# EAGLE design LCmeter0-LCD3310-8pinlcd-PIC-COMP (EAGLE 7.6.0)
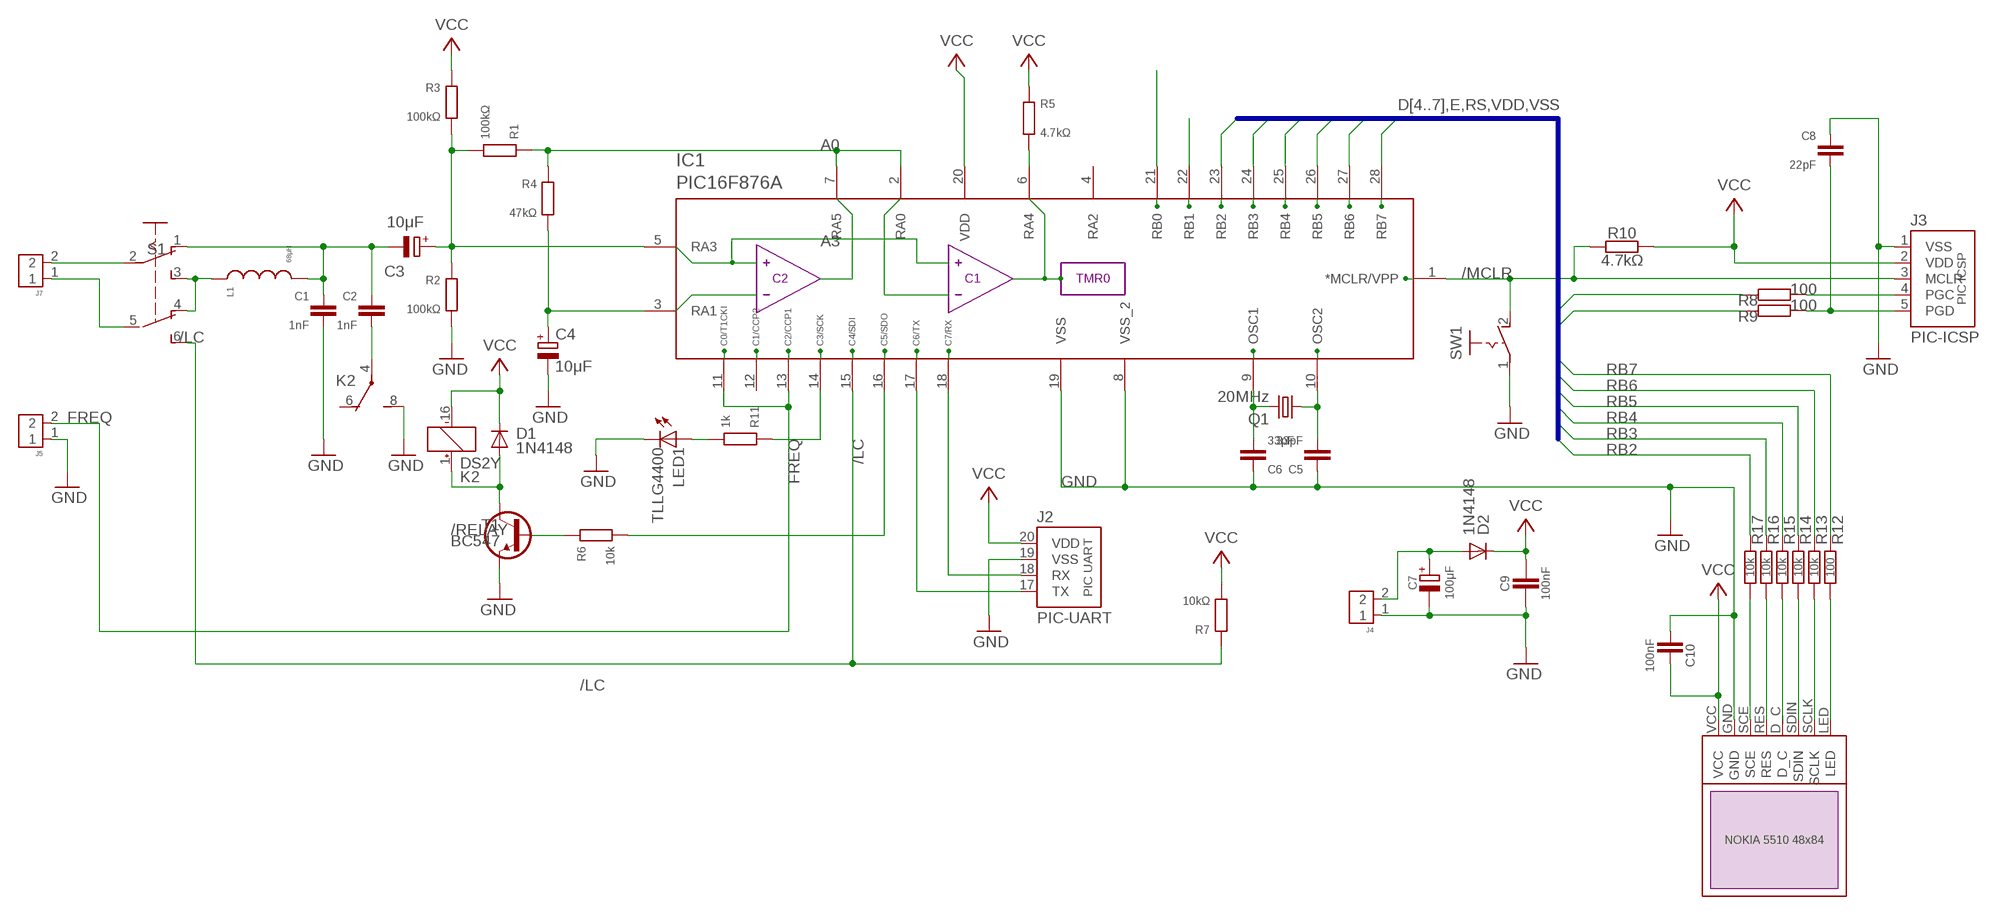
[diagram p0: schematic, sheet 1]

## Parts
C1  1nF  C025-025X060  [C050-025X060]
C2  1nF  C025-025X060  [C050-025X060]
C3  10μF  CPOLE2,5-4  [E2,5-4]
C4  10μF  CPOLE2,5-4  [E2,5-4]
C5  33pF  C025-020X036  [C025-020X036]
C6  33pF  C025-020X036  [C025-020X036]
C7  100μF  CPOLE5-5  [E5-5]
C8  22pF  C050-020X036  [C050-020X036]
C9  100nF  C-EU025-024X044  [C025-024X044]
C10  100nF  C025-015X024  [C025-015X024/V]
D1  1N4148  1N414834-7  [DO34-7]
D2  1N4148  1N414834-10V  [DO34-10V]
IC1  PIC16F876A  PIC16F876A-X/SP-COMPDIL28-3/V  [DIL28-3/V]
J2  PIC-UART  [PIC-UART]
J3  PIC-ICSP  PIC-ICSPICSP  [PIC-ICSP]
J4  J4  CONN-2P2P/H  [CONN-2P]
J5  CONN-2P2P/V  [CONN-2P-V]
J6  NOKIA-5510-48X84  [CONN-LCD5510]
J7  CONN-2P2P/V  [CONN-2P-V]
K2  DS2Y  DS2Y-S-DC5V  [DS2Y]
L1  68μH  L-09R  [L-09R]
LED1  TLLG4400  [LED3MM]
Q1  20MHz  CRYSTALHC49  [HC49]
R1  100kΩ  R0202/7  [0202/7]
R2  100kΩ  R0202/7  [0202/7]
R3  100kΩ  R0202/7  [0202/7]
R4  47kΩ  R0202/7  [0202/7]
R5  4.7kΩ  R0202/7  [0202/7]
R6  10k  R0202/7-V  [0202/7-V]
R7  10kΩ  R0202/10-V  [0202/10-V]
R8  100  R0202/7  [0202/7]
R9  100  R0202/2V  [0202/2V]
R10  4.7kΩ  R0202/7  [0202/7]
R11  1k  R0202/5-V  [0202/5-V]
R12  100  R0202/7  [0202/7]
R13  10k  R0202/7  [0202/7]
R14  10k  R0202/7  [0202/7]
R15  10k  R0202/7  [0202/7]
R16  10k  R0202/7  [0202/7]
R17  10k  R0202/7  [0202/7]
S1  SL-SW-2P-2T-H  [SLSW-2P2T-H]
SW1  PB-1P-1T  [PB-1P1T]
T1  BC547  BC547CBE-A  [TO92-CBE-A]

## Nets
/LC: IC1.15(RC4) R7.2 S1.6(S1)
/MCLR: IC1.1(*MCLR/VPP) J3.3(MCLR) R10.2 SW1.2(S)
/RELAY: D1.A K2.1(1:+) T1.C
A0: IC1.2(RA0) IC1.7(RA5) R1.2 R4.2
A1: C4.+ IC1.3(RA1) R4.1
A3: C3.+ IC1.5(RA3) R1.1 R2.2 R3.1
A4: IC1.6(RA4) R5.1
C2_CON: C2.2 K2.4(2:P)
FREQ: IC1.11(RC0) IC1.13(RC2) J5.2
GND: C1.2 C4.- C5.1 C6.1 C7.- C8.1 C9.2 C10.1 IC1.8(VSS_2) IC1.19(VSS) J2.19(VSS) J3.1(VSS) J4.1 J5.1 J6.GND K2.8(2:S) LED1.K(C) R2.1 SW1.1(P) T1.E
M+: J7.2 S1.2(P)
M-: J7.1 S1.5(P1)
N$1: LED1.A R11.1
N$2: C1.1 C2.1 C3.- L1.P$2 S1.1(O)
N$3: J6.LED R12.1
N$4: J6.D_C R15.1
N$5: IC1.14(RC3) R11.2
N$6: R6.2 T1.B
N$7: L1.P$1 S1.3(S) S1.4(O1)
N$8: IC1.16(RC5) R6.1
N$9: IC1.18(RC7) J2.18(RX)
N$10: IC1.17(RC6) J2.17(TX)
N$11: IC1.21(RB0)
N$12: C7.+ D2.A J4.2
N$13: J6.SDIN R14.1
N$14: J6.SCLK R13.1
N$15: J6.RES R16.1
N$16: J6.SCE R17.1
N$17: IC1.22(RB1)
OSC1: C6.2 IC1.9(OSC1) Q1.2
OSC2: C5.2 IC1.10(OSC2) Q1.1
PGC: J3.4(PGC) R8.1
PGD: C8.2 J3.5(PGD) R9.1
RB2: IC1.23(RB2) R17.2
RB3: IC1.24(RB3) R16.2
RB4: IC1.25(RB4) R15.2
RB5: IC1.26(RB5) R14.2
RB6: IC1.27(RB6) R8.2 R13.2
RB7: IC1.28(RB7) R9.2 R12.2
VCC: C9.1 C10.2 D1.C D2.C IC1.20(VDD) J2.20(VDD) J3.2(VDD) J6.VCC K2.16(1:-) R3.2 R5.2 R7.1 R10.1
Unconnected: IC1.4(RA2) IC1.12(RC1) K2.6(2:O) K2.9(3:S) K2.11(3:O) K2.13(3:P)

## Buses
D[4..7],E,RS,VDD,VSS

## Library data of the parts
C1 C2 C5 C6 C8 C10 = c:C: CAPACITOR, European symbol
C3 C4 C7 = c:CPOL: POLARIZED CAPACITOR, European symbol
C9 = rcl:C-EU: CAPACITOR, European symbol
D1 D2 = d:1N4148
IC1 = mcu:PIC16F876A-X/SP-COMP
J2 = pinconn:PIC-UART
J3 = pinconn:PIC-ICSP
J4 J5 J7 = pinconn:CONN-2P
J6 = lcd:NOKIA-5510-48X84
K2 = relay:DS2Y-S-DC*: MINIATURE RELAY NAiS Source: http://www.mew-europe.com/.. en_ds_61005_0023.pdf; MPN: DS2Y-S-DC5V; OC_FARNELL: unknown; OC_NEWARK: 13P3268
L1 = r:L
LED1 = led:TLLG4400: Low Current (2mA) LED 3 mm Tinted Diffused Package color GREEN Source: Data sheet <http://www.farnell.com/datasheets/391098.pdf>; MF: VISHAY SEMICONDUCTOR; OC_FARNELL: 1612435
Q1 = q:CRYSTAL
R1-R17 = r:R: RESISTOR, European symbol
S1 = sw:SL-SW-2P-2T
SW1 = sw:PB-1P-1T
T1 = t:BC547

## Net classes
0 default: width 0.61 mm

## Board
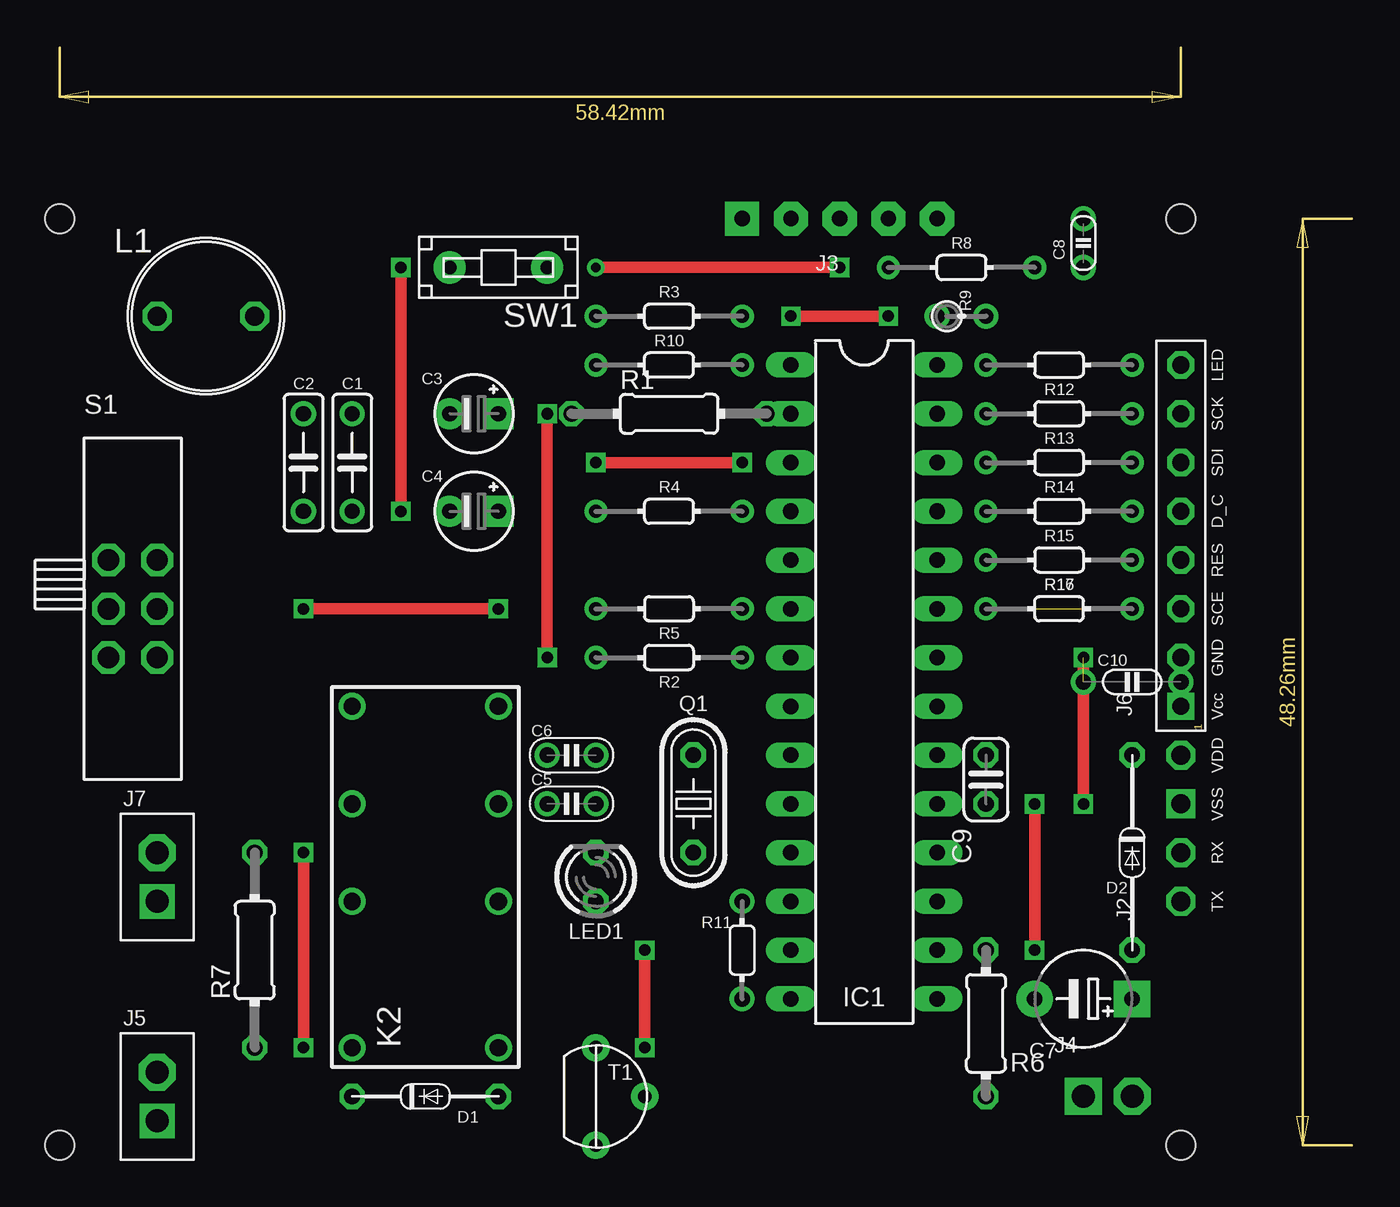
[diagram p1: board, top side]
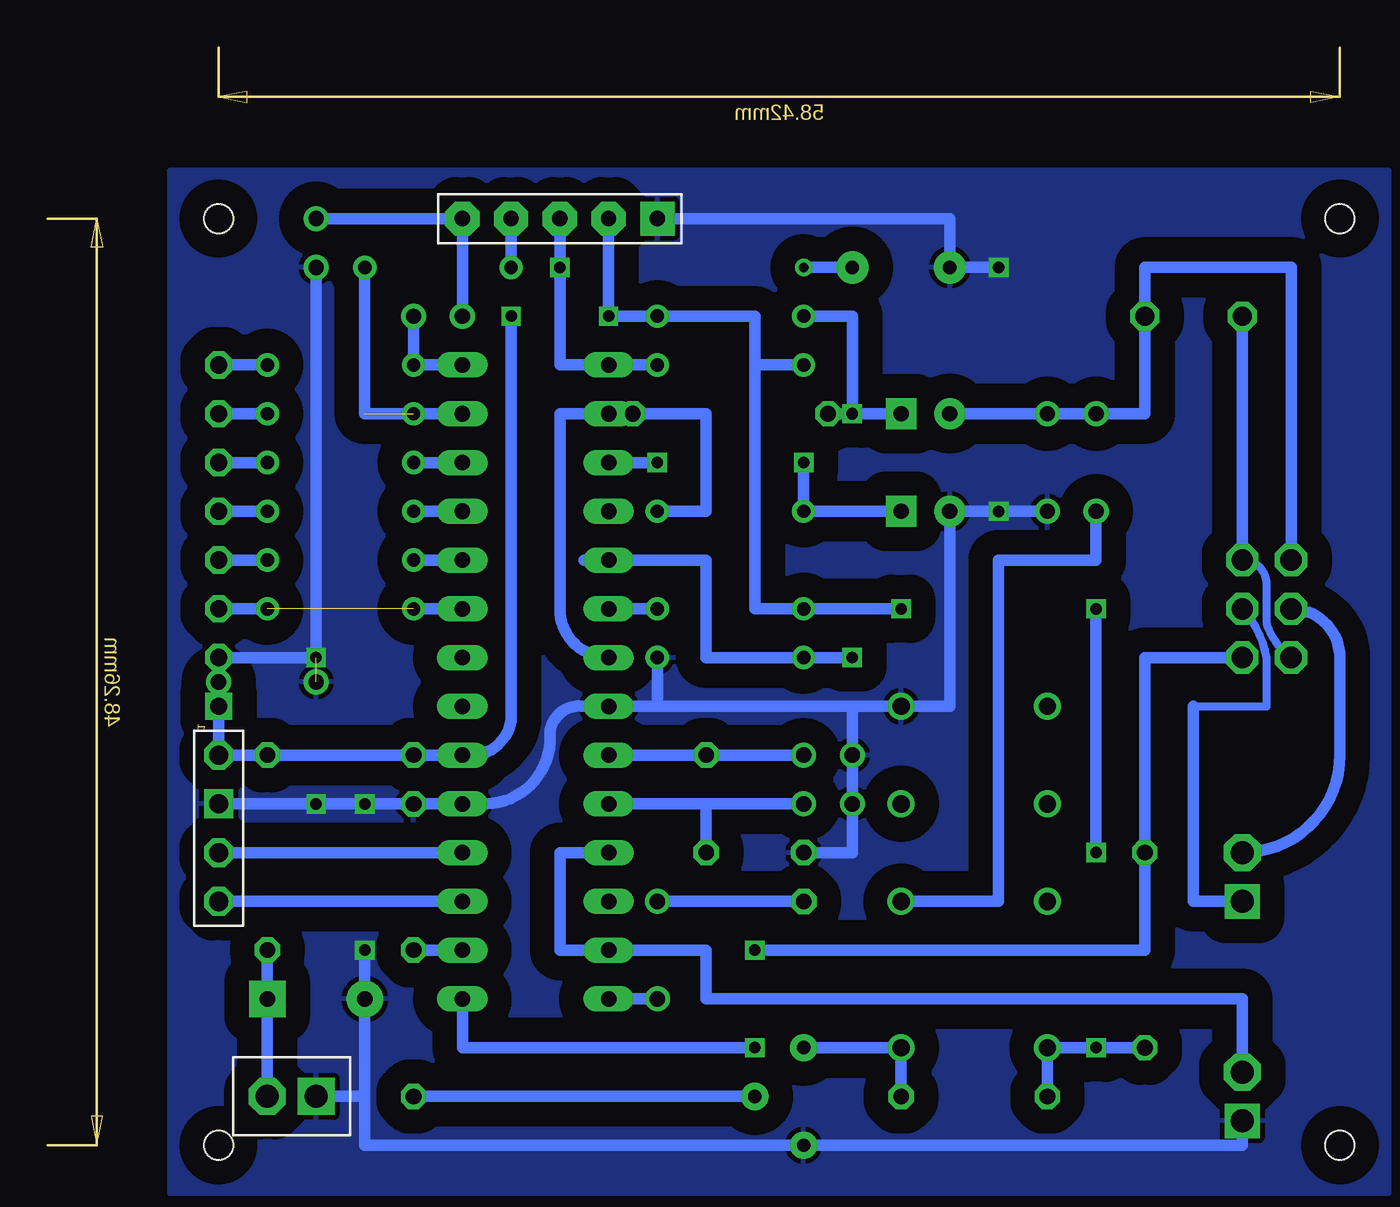
[diagram p2: board, bottom side, seen from below]

Size 67.31 x 57.15 mm. Coordinates in mm from the lower left corner, seen from the top.
Copper layers (1*16): Top 0.035mm / dielectric 1.5mm / Bottom 0.035mm
Design rules "default *": minimum track width 10mil, minimum drill 24mil, track to track 0mil, track to pad 0mil, pad to pad 0mil, via to via 0mil, smd to smd 8mil, copper to edge 40mil, drill to drill 8mil, minimum pad ring 10mil, minimum via ring 8mil, stop-mask expansion 4mil, vias tented up to drill 0mil, thermal gap 10mil
Holes 1.5 mm at 0,48.26 58.42,48.26 58.42,0 0,0

### Footprints (pad centres in the part's own frame; a part is rotated, then mirrored left to right if it is on the bottom)
C050-025X060 = drill 0.8: 1 0,2.54; 2 0,-2.54
E2,5-4 = drill 0.8 pad 1.6 square: + 1.27,0 | drill 0.8 pad 1.6: - -1.27,0
C025-020X036 = drill 0.8: 1 0,0; 2 2.54,0
E5-5 = drill 0.8 pad 1.905 square: + -2.54,0 | drill 0.8 pad 1.905: - 2.54,0
C025-015X024 = drill 0.8: 1 -1.27,0; 2 1.27,0
C025-024X044 = drill 0.813 octagon: 1 -1.27,0; 2 1.27,0
C050-020X036 = drill 0.8: 1 -2.54,0; 2 2.54,0
DO34-7 = drill 0.813 octagon: A 3.81,0; C -3.81,0
DO34-10V = drill 0.813 octagon: A 0,5.08; C 0,-5.08
DIL28-3/V = drill 0.813 long: 1 -3.81,16.51; 2 -3.81,13.97; 3 -3.81,11.43; 4 -3.81,8.89; 5 -3.81,6.35; 6 -3.81,3.81; 7 -3.81,1.27; 8 -3.81,-1.27; 9 -3.81,-3.81; 10 -3.81,-6.35; 11 -3.81,-8.89; 12 -3.81,-11.43; 13 -3.81,-13.97; 14 -3.81,-16.51; 15 3.81,-16.51; 16 3.81,-13.97; 17 3.81,-11.43; 18 3.81,-8.89; 19 3.81,-6.35; 20 3.81,-3.81; 21 3.81,-1.27; 22 3.81,1.27; 23 3.81,3.81; 24 3.81,6.35; 25 3.81,8.89; 26 3.81,11.43; 27 3.81,13.97; 28 3.81,16.51
PIC-UART = drill 1 octagon: 17 0,0; 18 0,2.54; 20 0,7.62 | drill 1 square: 19 0,5.08
PIC-ICSP = drill 0.8 pad 1.778 square: 1 -5.08,0 | drill 0.8 pad 1.778 octagon: 2 -2.54,0; 3 0,0; 4 2.54,0; 5 5.08,0
CONN-2P = drill 1.2 pad 1.93 square: 1 -1.27,0 | drill 1.2 pad 1.93 octagon: 2 1.27,0
CONN-2P-V = drill 1.2 pad 1.778 square: 1 0,-1.27 | drill 1.2 pad 1.93 octagon: 2 0,1.27
CONN-LCD5510 = drill 0.9 pad 1.422 octagon: D_C 0,1.27; GND 0,-6.35; LED 0,8.89; RES 0,-1.27; SCE 0,-3.81; SCLK 0,6.35; SDIN 0,3.81 | drill 0.9 pad 1.422 square: VCC 0,-8.89
DS2Y = drill 0.9: 1 -8.89,-3.81; 4 -1.27,-3.81; 6 3.81,-3.81; 8 8.89,-3.81; 9 8.89,3.81; 11 3.81,3.81; 13 -1.27,3.81; 16 -8.89,3.81
L-8R = drill 1 octagon: P$1 -2.54,0; P$2 2.54,0
LED3MM = drill 0.813 octagon: A -1.27,0; K 1.27,0
HC49 = drill 0.813 octagon: 1 0,-2.54; 2 0,2.54
0204/10 = drill 0.813 octagon: 1 -5.08,0; 2 5.08,0
0202/7@1 = drill 0.7: 1 -3.81,0; 2 3.81,0
0204/7-V = drill 0.813 octagon: 1 0,-3.81; 2 0,3.81
0202/2V = drill 0.8: 1 0,-1.27; 2 0,1.27
0202/5-V = drill 0.8: 1 0,2.54; 2 0,-2.54
SLSW-2P2T-H = drill 1.118 pad 1.524 octagon: 1 -1.27,2.54; 2 -1.27,0; 3 -1.27,-2.54; 4 1.27,2.54; 5 1.27,0; 6 1.27,-2.54
PB-1P1T = drill 0.7 pad 1.676: 1 2.54,0; 2 -2.54,0
TO92-CBE-A = drill 0.7 pad 1.422: B 2.54,0; C 0,2.54; E 0,-2.54

### Placement (x,y rotation side)
C1  15.24,35.56 0 top
C2  12.7,35.56 0 top
C3  21.59,38.1 0 top
C4  21.59,33.02 0 top
C5  25.4,17.78 0 top
C6  25.4,20.32 0 top
C7  53.34,7.62 180 top
C8  22pF  [C025-015X024]  53.34,46.99 90 top
C9  48.26,19.05 270 top
C10  100nF  [C050-020X036]  55.88,24.13 0 top
D1  19.05,2.54 0 top
D2  55.88,15.24 180 top
IC1  41.91,24.13 0 top
J2  58.42,12.7 0 top
J3  40.64,48.26 0 top
J4  54.61,2.54 0 top
J5  5.08,2.54 0 top
J6  58.42,31.75 0 top
J7  5.08,13.97 0 top
K2  19.05,13.97 90 top
L1  68μH  [L-8R]  7.62,43.18 0 top
LED1  27.94,13.97 90 top
Q1  33.02,17.78 0 top
R1  100kΩ  [0204/10]  31.75,38.1 0 top
R2  100kΩ  [0202/7@1]  31.75,25.4 180 top
R3  100kΩ  [0202/7@1]  31.75,43.18 0 top
R4  47kΩ  [0202/7@1]  31.75,33.02 0 top
R5  4.7kΩ  [0202/7@1]  31.75,27.94 180 top
R6  10kΩ  [0204/7-V]  48.26,6.35 180 top
R7  10kΩ  [0204/10]  10.16,10.16 90 top
R8  100Ω  [0202/7@1]  46.99,45.72 0 top
R9  100Ω  [0202/2V]  46.99,43.18 270 top
R10  4.7kΩ  [0202/7@1]  31.75,40.64 0 top
R11  1kΩ  [0202/5-V]  35.56,10.16 0 top
R12  100Ω  [0202/7@1]  52.07,40.64 180 top
R13  10kΩ  [0202/7@1]  52.07,38.1 180 top
R14  10kΩ  [0202/7@1]  52.07,35.56 180 top
R15  10kΩ  [0202/7@1]  52.07,33.02 180 top
R16  10kΩ  [0202/7@1]  52.07,30.48 180 top
R17  10kΩ  [0202/7@1]  52.07,27.94 0 top
S1  3.81,27.94 0 top
SW1  22.86,45.72 180 top
T1  27.94,2.54 0 top

### Tracks (layer width: path | path; a pad name or v marks a point on that pad's centre or on a via)
/LC  (via drill 0.6)
  Top 0.61: v30.48,10.16 v30.48,5.08
  Bottom 0.61: IC1.15 45.72,5.08 v30.48,5.08 32.85,5.08 | v30.48,10.16 10.16,10.16 R7.2 10.16,25.4 S1.6
/MCLR  (via drill 0.5, 0.6)
  Top 0.61: v27.94,45.72 v40.64,45.72
  Bottom 0.61: J3.3 v40.64,45.72 40.64,40.64 IC1.1 R10.2 | v27.94,45.72 SW1.2
/RELAY
  Bottom 0.61: T1.C K2.1 D1.A
A0
  Bottom 0.61: IC1.7 arc90 40.64,27.94 40.64,38.1 IC1.2 R1.2 33.02,38.1 33.02,33.02 R4.2
A1  (via drill 0.6)
  Top 0.61: v27.94,35.56 v35.56,35.56
  Bottom 0.61: v35.56,35.56 IC1.3 | C4.+ R4.1 v27.94,35.56
A3  (via drill 0.6)
  Top 0.61: v25.4,38.1 v25.4,25.4
  Bottom 0.61: 39.37,30.48 IC1.5 33.02,30.48 33.02,25.4 R2.2 v25.4,25.4 | R3.1 25.4,43.18 v25.4,38.1 | v25.4,38.1 R1.1 | v25.4,38.1 C3.+
A4
  Bottom 0.61: R5.1 IC1.6
C2_CON
  Bottom 0.61: K2.4 17.78,12.7 17.78,30.48 12.7,30.48 C2.2
FREQ
  Bottom 0.61: IC1.11 40.64,15.24 40.64,10.16 IC1.13 33.02,10.16 33.02,7.62 5.08,7.62 J5.2
GND  (via drill 0.6)  (1 unrouted)
  Top 0.61: v53.34,25.4 v53.34,17.78 | v50.8,10.16 v50.8,17.78 | v17.78,45.72 v17.78,33.02
  Bottom 0.61: 35.56,22.86 IC1.8 39.37,22.86 arc-90 41.15,21.59 41.15,21.34 arc90 44.45,17.78 IC1.19 C9.2 v50.8,17.78 v53.34,17.78 J2.19 | 25.4,22.86 C6.1 C5.1 25.4,15.24 LED1.K | 25.4,22.86 35.56,22.86 | 35.56,22.86 R2.1 | 25.4,22.86 K2.8 20.32,22.86 C4.- v17.78,33.02 C1.2 | v17.78,45.72 SW1.1 20.32,48.26 J3.1 | J5.1 5.08,0 T1.E 50.8,0 50.8,2.54 | 50.8,2.54 C7.- v50.8,10.16 | 50.8,2.54 J4.1 | J6.GND v53.34,25.4 C8.1
  pour Bottom (isolate 1.27): -2.54,50.8 -2.54,-2.54 60.96,-2.54 60.96,50.8
M+
  Bottom 0.61: J7.2 arc-90 0,20.32 0,25.4 arc-90 S1.2
M-
  Bottom 0.406: 7.62,22.86 3.81,22.86 3.81,25.4 arc-33 S1.5
  Bottom 0.61: 7.62,22.86 7.62,12.7 J7.1
N$1
  Bottom 0.61: R11.1 LED1.A
N$2
  Bottom 0.61: C3.- C1.1 C2.1 10.16,38.1 L1.P$2 10.16,45.72 2.54,45.72 S1.1
N$3
  Bottom 0.61: J6.LED R12.1
N$4
  Bottom 0.61: J6.D_C R15.1
N$5
  Bottom 0.61: R11.2 IC1.14
N$6
  Bottom 0.61: T1.B R6.2
N$7
  Bottom 0.406: S1.3 arc37 3.81,27.18 3.81,29.21 arc-90 S1.4
  Bottom 0.61: S1.4 L1.P$1
N$8
  Bottom 0.61: R6.1 IC1.16
N$9
  Bottom 0.61: IC1.18 J2.18
N$10
  Bottom 0.61: IC1.17 J2.17
N$12
  Bottom 0.61: D2.A C7.+ J4.2
N$13
  Bottom 0.61: R14.1 J6.SDIN
N$14
  Bottom 0.61: R13.1 J6.SCLK
N$15
  Bottom 0.61: R16.1 J6.RES
N$16  (1 unrouted)
  Bottom 0.61: J6.SCE 55.88,27.94
OSC1
  Bottom 0.61: IC1.9 Q1.2 C6.2
OSC2
  Bottom 0.61: 33.02,17.78 C5.2 | IC1.10 33.02,17.78 | 33.02,17.78 Q1.1
PGC
  Bottom 0.61: J3.4 R8.1
PGD
  Bottom 0.61: C8.2 J3.5 R9.1
RB2  (1 unrouted)
  Bottom 0.61: IC1.23 48.26,27.94
RB3
  Bottom 0.61: R16.2 IC1.24
RB4
  Bottom 0.61: IC1.25 R15.2
RB5
  Bottom 0.61: R14.2 IC1.26
RB6  (1 unrouted)
  Bottom 0.61: IC1.27 50.8,38.1 R8.2
RB7
  Bottom 0.61: R9.2 R12.2 IC1.28
VCC  (via drill 0.6)
  Top 0.61: v12.7,15.24 v12.7,5.08 | v12.7,27.94 v22.86,27.94 | v43.18,43.18 v38.1,43.18
  Bottom 0.61: R7.1 v12.7,5.08 K2.16 D1.C | J2.20 D2.C | 30.48,40.64 30.48,27.94 R5.2 v22.86,27.94 | v38.1,43.18 R3.2 30.48,43.18 30.48,40.64 | v12.7,15.24 v12.7,27.94 | v43.18,43.18 43.18,22.1 arc70 44.96,20.32 IC1.20 C9.1 J2.20 | J3.2 v38.1,43.18 | 33.02,43.18 v38.1,43.18 | R10.1 30.48,40.64 | C10.2 J6.VCC J2.20

### Text on the board
Dimension: 20 | 19 | 18 | 17 | 16 | 15 | 14 | 13 | 12 | 11 | 10 | 9 | 8 | 7 | 6 | 5 | 4 | 3 | 2 | 1 | 1 | 2 | 3 | 4 | 5 | 6 | 7 | 8 | 9 | 10 | 11 | 12 | 13 | 14 | 15 | 16 | 17 | 18 | 19 | 20 | 21 | 22 | 23 | 24